# EAGLE schematic BatteryChargerCombiner (EAGLE 8.5.0)
Assembly variants: Wing, Hull

## Sheet 1 of 2
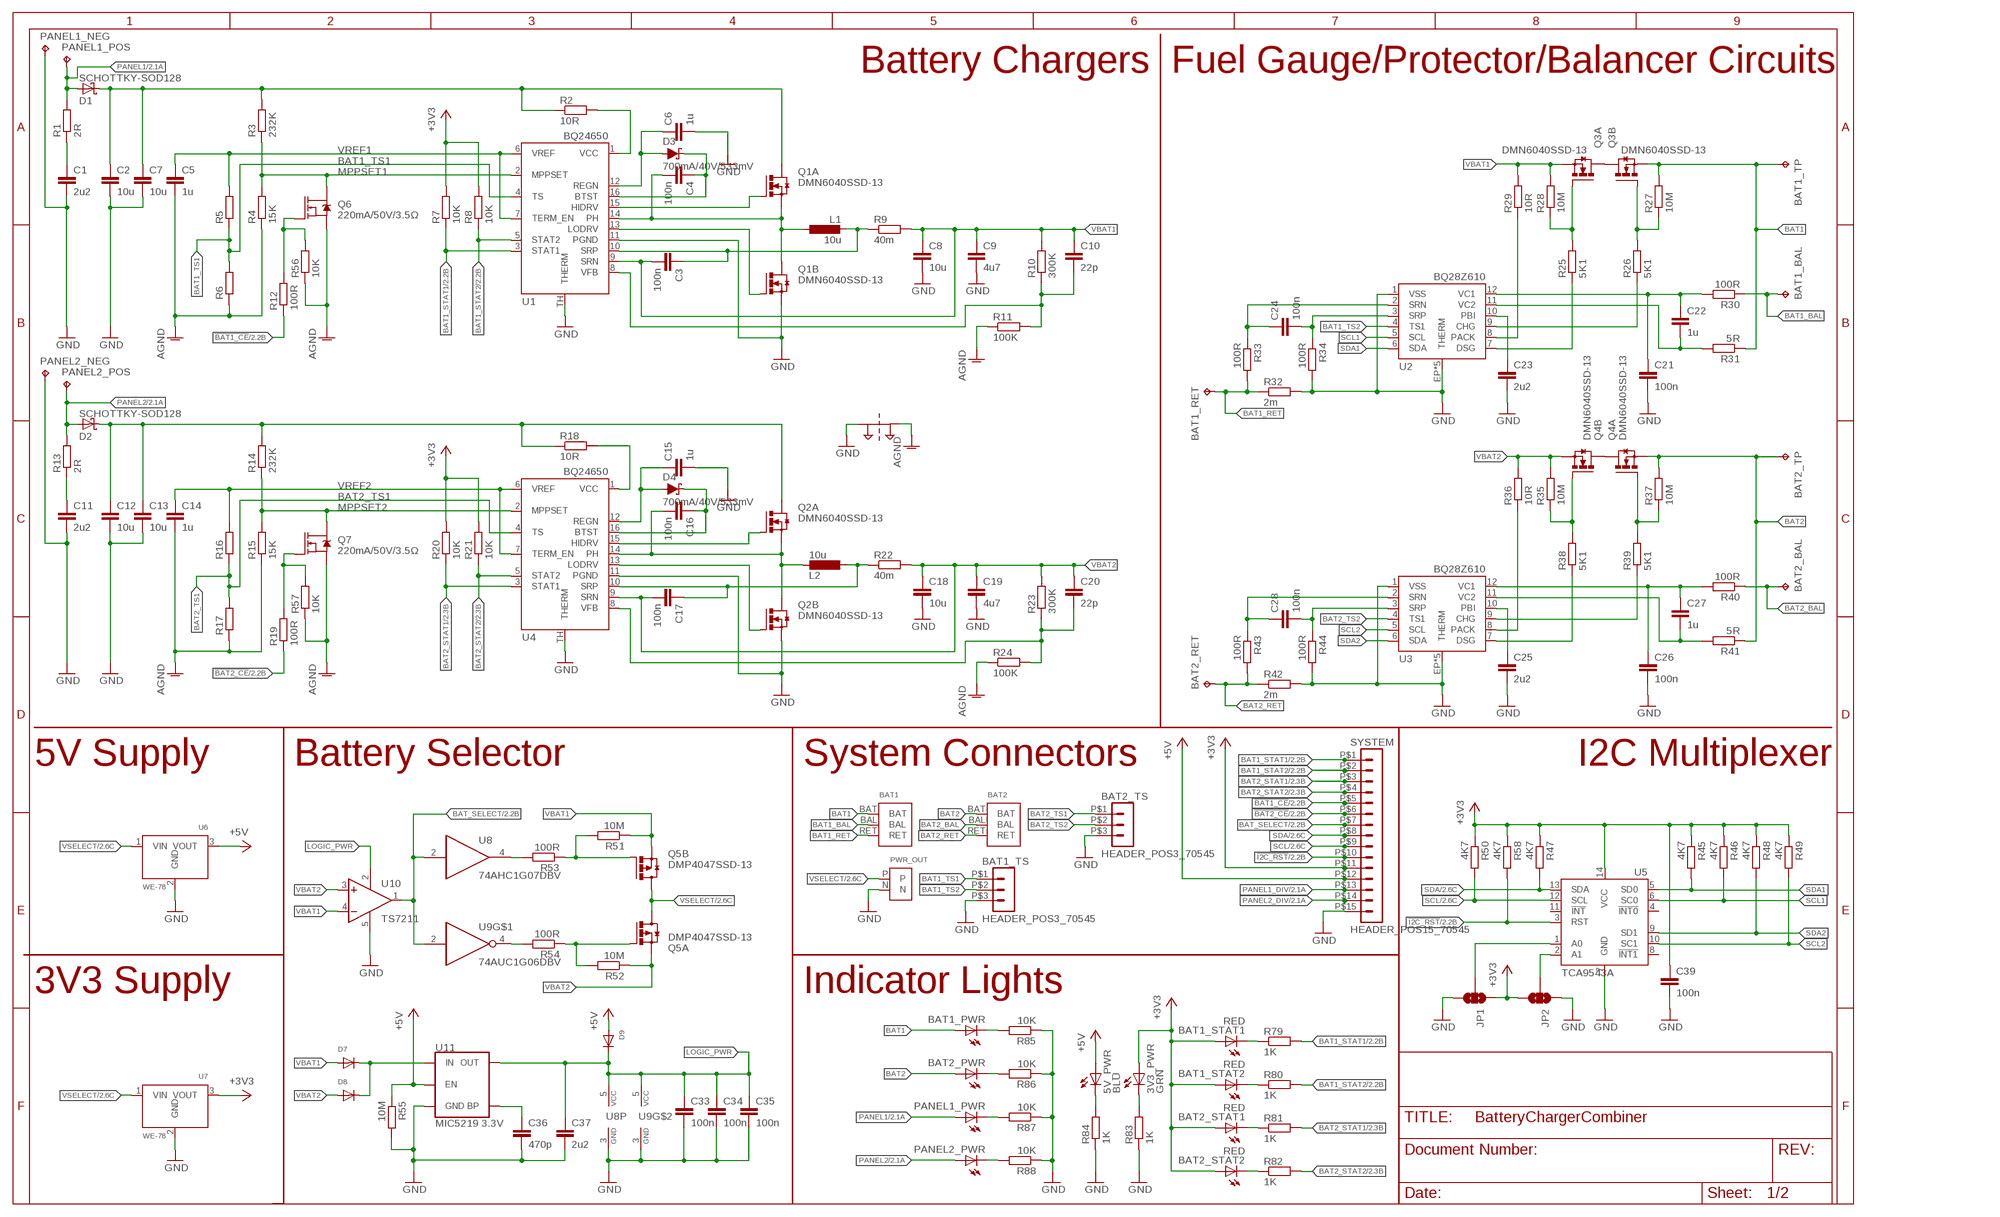
[diagram p0: schematic, sheet 1]

### Parts
3V3_PWR  GRN  LEDCHIP-LED0603  [CHIP-LED0603]
5V_PWR  BLU  LEDCHIP-LED0603  [CHIP-LED0603]
BAT1  2S-BATTERYSMD  [JST-XH3-SMD]
BAT1_BAL  TPPAD1-13Y  [P1-13Y]  (not fitted in variant Wing)  (not fitted in variant Hull)
BAT1_PWR  LEDCHIP-LED0603  [CHIP-LED0603]
BAT1_RET  TPPAD1-13Y  [P1-13Y]  (not fitted in variant Wing)  (not fitted in variant Hull)
BAT1_STAT1  RED  LEDCHIP-LED0603  [CHIP-LED0603]
BAT1_STAT2  RED  LEDCHIP-LED0603  [CHIP-LED0603]
BAT1_TP  TPPAD1-13Y  [P1-13Y]  (not fitted in variant Wing)  (not fitted in variant Hull)
BAT1_TS  HEADER_POS3_70545  [70545-POS3]
BAT2  2S-BATTERYSMD  [JST-XH3-SMD]
BAT2_BAL  TPPAD1-13Y  [P1-13Y]  (not fitted in variant Wing)  (not fitted in variant Hull)
BAT2_PWR  LEDCHIP-LED0603  [CHIP-LED0603]
BAT2_RET  TPPAD1-13Y  [P1-13Y]  (not fitted in variant Wing)  (not fitted in variant Hull)
BAT2_STAT1  RED  LEDCHIP-LED0603  [CHIP-LED0603]
BAT2_STAT2  RED  LEDCHIP-LED0603  [CHIP-LED0603]
BAT2_TP  TPPAD1-13Y  [P1-13Y]  (not fitted in variant Wing)  (not fitted in variant Hull)
BAT2_TS  HEADER_POS3_70545  [70545-POS3]
C1  2u2  C-EUC0603  [C0603]
C2  10u  C-EUC1210  [C1210]
C3  100n  C-EUC0603  [C0603]
C4  100n  C-EUC0603  [C0603]
C5  1u  C-EUC0603  [C0603]
C6  1u  C-EUC0603  [C0603]
C7  10u  C-EUC1210  [C1210]
C8  10u  C-EUC1210  [C1210]
C9  4u7  C-EUC1210  [C1210]
C10  22p  C-EUC0603  [C0603]
C11  2u2  C-EUC0603  [C0603]
C12  10u  C-EUC1210  [C1210]
C13  10u  C-EUC1210  [C1210]
C14  1u  C-EUC0603  [C0603]
C15  1u  C-EUC0603  [C0603]
C16  100n  C-EUC0603  [C0603]
C17  100n  C-EUC0603  [C0603]
C18  10u  C-EUC1210  [C1210]
C19  4u7  C-EUC1210  [C1210]
C20  22p  C-EUC0603  [C0603]
C21  100n  C-EUC0603  [C0603]
C22  1u  C-EUC0603  [C0603]
C23  2u2  C-EUC0603  [C0603]
C24  100n  C-EUC0603  [C0603]
C25  2u2  C-EUC0603  [C0603]
C26  100n  C-EUC0603  [C0603]
C27  1u  C-EUC0603  [C0603]
C28  100n  C-EUC0603  [C0603]
C33  100n  C-EUC0603  [C0603]
C34  100n  C-EUC0603  [C0603]
C35  100n  C-EUC0603  [C0603]
C36  470p  C-EUC0603  [C0603]
C37  2u2  C-EUC0603  [C0603]
C39  100n  C-EUC0603  [C0603]
D1  SCHOTTKY-SOD128  [SOD-128]
D2  SCHOTTKY-SOD128  [SOD-128]
D3  700mA/40V/533mV  DIODE-SCHOTTKY-ZLLS500  [SOT23-3]
D4  700mA/40V/533mV  DIODE-SCHOTTKY-ZLLS500  [SOT23-3]
D7  DIODESOD-123  [SOD-123]
D8  DIODESOD-123  [SOD-123]
D9  DIODESOD-123  [SOD-123]
JP1  JUMPER-SMT_3_NO_SILK  [SMT-JUMPER_3_NO_SILK]  (not fitted in variant Wing)  (not fitted in variant Hull)
JP2  JUMPER-SMT_3_NO_SILK  [SMT-JUMPER_3_NO_SILK]  (not fitted in variant Wing)  (not fitted in variant Hull)
L1  10u  INDUCTOR-DG6050  [DG6050]
L2  10u  INDUCTOR-DG6050  [DG6050]
PANEL1_NEG  TPPAD1-13Y  [P1-13Y]  (not fitted in variant Wing)  (not fitted in variant Hull)
PANEL1_POS  TPPAD1-13Y  [P1-13Y]  (not fitted in variant Wing)  (not fitted in variant Hull)
PANEL1_PWR  LEDCHIP-LED0603  [CHIP-LED0603]
PANEL2_NEG  TPPAD1-13Y  [P1-13Y]  (not fitted in variant Wing)  (not fitted in variant Hull)
PANEL2_POS  TPPAD1-13Y  [P1-13Y]  (not fitted in variant Wing)  (not fitted in variant Hull)
PANEL2_PWR  LEDCHIP-LED0603  [CHIP-LED0603]
PWR_OUT  PWR  [JST-XH2-THRUHOLE]  (not fitted in variant Wing)
Q1  DMN6040SSD-13  IRF8313P  [SO-08]
Q2  DMN6040SSD-13  IRF8313P  [SO-08]
Q3  DMN6040SSD-13  IRF8313P  [SO-08]
Q4  DMN6040SSD-13  IRF8313P  [SO-08]
Q5  DMP4047SSD-13  [SO08]
Q6  220mA/50V/3.5Ω  MOSFET-NCH-BSS138  [SOT23-3]
Q7  220mA/50V/3.5Ω  MOSFET-NCH-BSS138  [SOT23-3]
R1  2R  R-EU_R0603  [R0603]
R2  10R  R-EU_R1206  [R1206]
R3  232K  R-EU_R0603  [R0603]
R4  15K  R-EU_R0603  [R0603]
R5  R-EU_R0603  [R0603]
R6  R-EU_R0603  [R0603]
R7  10K  R-EU_R0603  [R0603]
R8  10K  R-EU_R0603  [R0603]
R9  40m  R-EU_R2512  [R2512]
R10  300K  R-EU_R0603  [R0603]
R11  100K  R-EU_R0603  [R0603]
R12  100R  R-EU_R0603  [R0603]
R13  2R  R-EU_R0603  [R0603]
R14  232K  R-EU_R0603  [R0603]
R15  15K  R-EU_R0603  [R0603]
R16  R-EU_R0603  [R0603]
R17  R-EU_R0603  [R0603]
R18  10R  R-EU_R1206  [R1206]
R19  100R  R-EU_R0603  [R0603]
R20  10K  R-EU_R0603  [R0603]
R21  10K  R-EU_R0603  [R0603]
R22  40m  R-EU_R2512  [R2512]
R23  300K  R-EU_R0603  [R0603]
R24  100K  R-EU_R0603  [R0603]
R25  5K1  R-EU_R0603  [R0603]
R26  5K1  R-EU_R0603  [R0603]
R27  10M  R-EU_R0603  [R0603]
R28  10M  R-EU_R0603  [R0603]
R29  10R  R-EU_R0603  [R0603]
R30  100R  R-EU_R0603  [R0603]
R31  5R  R-EU_R0603  [R0603]
R32  2m  R-EU_R2512  [R2512]
R33  100R  R-EU_R0603  [R0603]
R34  100R  R-EU_R0603  [R0603]
R35  10M  R-EU_R0603  [R0603]
R36  10R  R-EU_R0603  [R0603]
R37  10M  R-EU_R0603  [R0603]
R38  5K1  R-EU_R0603  [R0603]
R39  5K1  R-EU_R0603  [R0603]
R40  100R  R-EU_R0603  [R0603]
R41  5R  R-EU_R0603  [R0603]
R42  2m  R-EU_R2512  [R2512]
R43  100R  R-EU_R0603  [R0603]
R44  100R  R-EU_R0603  [R0603]
R45  4K7  R-EU_R0603  [R0603]
R46  4K7  R-EU_R0603  [R0603]
R47  4K7  R-EU_R0603  [R0603]
R48  4K7  R-EU_R0603  [R0603]
R49  4K7  R-EU_R0603  [R0603]
R50  4K7  R-EU_R0603  [R0603]
R51  10M  R-EU_R0603  [R0603]
R52  10M  R-EU_R0603  [R0603]
R53  100R  R-EU_R0603  [R0603]
R54  100R  R-EU_R0603  [R0603]
R55  10M  R-EU_R0603  [R0603]
R56  10K  R-EU_R0603  [R0603]
R57  10K  R-EU_R0603  [R0603]
R58  4K7  R-EU_R0603  [R0603]
R79  1K  R-EU_R0603  [R0603]
R80  1K  R-EU_R0603  [R0603]
R81  1K  R-EU_R0603  [R0603]
R82  1K  R-EU_R0603  [R0603]
R83  1K  R-EU_R0603  [R0603]
R84  1K  R-EU_R0603  [R0603]
R85  10K  R-EU_R0603  [R0603]
R86  10K  R-EU_R0603  [R0603]
R87  10K  R-EU_R0603  [R0603]
R88  10K  R-EU_R0603  [R0603]
SUPPLY1  2PT_GND_TIE  [2PT_GND_TIE]  (not fitted in variant Wing)  (not fitted in variant Hull)
SYSTEM  HEADER_POS15_70545  [70545-POS15]  (not fitted in variant Wing)
U1  BQ24650  [QFN16]
U2  BQ28Z610  [PDSO-N12]
U3  BQ28Z610  [PDSO-N12]
U4  BQ24650  [QFN16]
U5  TCA9543A  [SO-14]
U6  WE-78  [WE-78]
U7  WE-78  [WE-78]
U8  74AHC1G07DBV  [SOT23-5]
U9  74AUC1G06DBV  [SOT23-5]
U10  TS7211  [DBV-R-PDSO-G5]
U11  MIC5219 3.3V  V_REG_MIC52193.3V  [SOT23-5]

### Nets
!BAT1_CE!: R12.1 SYSTEM.P$5 ; also sheet 2
!BAT2_CE!: R19.1 SYSTEM.P$6 ; also sheet 2
!I2C_RST!: R58.2 SYSTEM.P$10 U5.3(RST) ; also sheet 2
+3V3: 3V3_PWR.A BAT1_STAT1.A BAT1_STAT2.A BAT2_STAT1.A BAT2_STAT2.A C39.1 JP1.1 JP2.3 R7.2 R8.2 R20.2 R21.2 R45.1 R46.1 R47.1 R48.1 R49.1 R50.1 R58.1 SYSTEM.P$11 U5.14(VCC) U7.3(VOUT) ; also sheet 2
+5V: 5V_PWR.A D9.A R55.1 SYSTEM.P$12 U6.3(VOUT) U11.3(EN) ; also sheet 2
AGND: C5.2 C14.2 Q6.2(S) Q7.2(S) R4.1 R6.1 R11.1 R15.1 R17.1 R24.1 R56.1 R57.1 SUPPLY1.P$2
BAT1: BAT1.BAT BAT1_PWR.A BAT1_TP.TP Q3.1(B:S) R27.2 R31.1
BAT1_BAL: BAT1.BAL BAT1_BAL.TP R30.1
BAT1_RET: BAT1.RET BAT1_RET.TP R32.1 R33.2
BAT1_STAT1: R7.1 R79.2 SYSTEM.P$1 U1.3(STAT1) ; also sheet 2
BAT1_STAT2: R8.1 R80.2 SYSTEM.P$2 U1.5(STAT2) ; also sheet 2
BAT1_TS1: BAT1_TS.P$1 R5.1 R6.2 U1.4(TS)
BAT1_TS2: BAT1_TS.P$2 U2.4(TS1)
BAT2: BAT2.BAT BAT2_PWR.A BAT2_TP.TP Q4.3(A:S) R37.2 R41.1
BAT2_BAL: BAT2.BAL BAT2_BAL.TP R40.1
BAT2_RET: BAT2.RET BAT2_RET.TP R42.1 R43.2
BAT2_STAT1: R20.1 R81.2 SYSTEM.P$3 U4.3(STAT1) ; also sheet 2
BAT2_STAT2: R21.1 R82.2 SYSTEM.P$4 U4.5(STAT2) ; also sheet 2
BAT2_TS1: BAT2_TS.P$1 R16.1 R17.2 U4.4(TS)
BAT2_TS2: BAT2_TS.P$2 U3.4(TS1)
BAT_SELECT: SYSTEM.P$7 U8.2(I) U9.2(I) U10.1(OUT) ; also sheet 2
GND: BAT1_TS.P$3 BAT2_TS.P$3 C1.2 C2.2 C6.2 C7.2 C8.2 C9.2 C11.2 C12.2 C13.2 C15.2 C18.2 C19.2 C21.2 C23.2 C25.2 C26.2 C33.2 C34.2 C35.2 C36.2 C37.2 C39.2 JP1.3 JP2.1 PANEL1_NEG.TP PANEL2_NEG.TP PWR_OUT.N Q1.1(B:S) Q2.1(B:S) R32.2 R34.2 R42.2 R44.2 R55.2 R83.1 R84.1 R85.1 R86.1 R87.1 R88.1 SUPPLY1.P$1 SYSTEM.P$15 U1.11(PGND) U1.TH(THERM) U2.1(VSS) U2.EP1(THERM) U2.EP2(THERM) U2.EP3(THERM) U2.EP4(THERM) U2.EP(THERM) U3.1(VSS) U3.EP1(THERM) U3.EP2(THERM) U3.EP3(THERM) U3.EP4(THERM) U3.EP(THERM) U4.11(PGND) U4.TH(THERM) U5.7(GND) U6.2(GND) U7.2(GND) U8.3(GND) U9.3(GND) U10.5(GND) U11.2(GND) ; also sheet 2
LOGIC_PWR: C33.1 C34.1 C35.1 C37.1 D9.C U8.5(VCC) U9.5(VCC) U10.2(V+) U11.5(OUT)
MPPSET1: Q6.3(D) R3.1 R4.2 U1.2(MPPSET)
MPPSET2: Q7.3(D) R14.1 R15.2 U4.2(MPPSET)
N$1: C1.1 R1.1
N$3: R2.2 U1.1(VCC)
N$4: C2.1 C7.1 D1.C Q1.5(A:D) Q1.6(A:D) R2.1 R3.2
N$5: Q1.4(A:G) U1.15(HIDRV)
N$6: C4.2 L1.1 Q1.3(A:S) Q1.7(B:D) Q1.8(B:D) U1.14(PH)
N$7: Q1.2(B:G) U1.13(LODRV)
N$8: Q6.1(G) R12.2 R56.2
N$9: C3.1 L1.2 R9.1 U1.10(SRP)
N$10: C4.1 D3.3(C) U1.16(BTST)
N$11: C6.1 D3.1(A) U1.12(REGN)
N$12: C10.2 R10.1 R11.2 U1.8(VFB)
N$13: Q2.4(A:G) U4.15(HIDRV)
N$14: BAT1_STAT1.C R79.1
N$15: C11.1 R13.1
N$16: C15.1 D4.1(A) U4.12(REGN)
N$17: C16.1 D4.3(C) U4.16(BTST)
N$18: R29.1 U2.8(PACK)
N$19: C12.1 C13.1 D2.C Q2.5(A:D) Q2.6(A:D) R14.2 R18.1
N$20: C16.2 L2.2 Q2.3(A:S) Q2.7(B:D) Q2.8(B:D) U4.14(PH)
N$21: Q2.2(B:G) U4.13(LODRV)
N$22: C17.1 L2.1 R22.1 U4.10(SRP)
N$23: R18.2 U4.1(VCC)
N$24: Q7.1(G) R19.2 R57.2
N$25: Q3.5(A:D) Q3.6(A:D) Q3.7(B:D) Q3.8(B:D)
N$26: Q3.4(A:G) R25.2 R28.1
N$27: C20.2 R23.1 R24.2 U4.8(VFB)
N$28: Q3.2(B:G) R26.2 R27.1
N$29: R25.1 U2.7(DSG)
N$30: Q4.5(A:D) Q4.6(A:D) Q4.7(B:D) Q4.8(B:D)
N$31: R26.1 U2.9(CHG)
N$32: C21.1 C22.1 R30.2 U2.12(VC1)
N$33: C22.2 R31.2 U2.11(VC2)
N$34: C23.1 U2.10(PBI)
N$35: C27.2 R41.2 U3.11(VC2)
N$36: C28.1 R43.1 U3.2(SRN)
N$37: C24.1 R33.1 U2.2(SRN)
N$38: Q4.2(B:G) R35.1 R38.2
N$39: C24.2 R34.1 U2.3(SRP)
N$40: Q4.4(A:G) R37.1 R39.2
N$41: C26.1 C27.1 R40.2 U3.12(VC1)
N$42: R36.1 U3.8(PACK)
N$43: R38.1 U3.7(DSG)
N$44: R39.1 U3.9(CHG)
N$45: C25.1 U3.10(PBI)
N$46: C28.2 R44.1 U3.3(SRP)
N$47: BAT1_STAT2.C R80.1
N$48: Q5.4(B:G) R51.2 R53.1
N$49: BAT2_STAT1.C R81.1
N$50: JP1.2 U5.1(A0)
N$51: JP2.2 U5.2(A1)
N$52: Q5.2(A:G) R52.2 R54.1
N$54: R54.2 U9.4(O)
N$55: R53.2 U8.4(O)
N$56: BAT2_STAT2.C R82.1
N$57: D7.C D8.C U11.1(IN)
N$59: C36.1 U11.4(BP)
N$74: 3V3_PWR.C R83.2
N$77: 5V_PWR.C R84.2
N$81: BAT1_PWR.C R85.2
N$82: BAT2_PWR.C R86.2
N$83: PANEL1_PWR.C R87.2
N$84: PANEL2_PWR.C R88.2
PANEL1: D1.A PANEL1_POS.TP PANEL1_PWR.A R1.2 ; also sheet 2
PANEL1_DIV: SYSTEM.P$13 ; also sheet 2
PANEL2: D2.A PANEL2_POS.TP PANEL2_PWR.A R13.2 ; also sheet 2
PANEL2_DIV: SYSTEM.P$14 ; also sheet 2
SCL: R50.2 SYSTEM.P$9 U5.12(SCL) ; also sheet 2
SCL1: R46.2 U2.5(SCL) U5.6(SC0)
SCL2: R49.2 U3.5(SCL) U5.10(SC1)
SDA: R47.2 SYSTEM.P$8 U5.13(SDA) ; also sheet 2
SDA1: R45.2 U2.6(SDA) U5.5(SD0)
SDA2: R48.2 U3.6(SDA) U5.9(SD1)
VBAT1: C3.2 C8.1 C9.1 C10.1 D7.A Q3.3(A:S) Q5.3(B:S) R9.2 R10.2 R28.2 R29.2 R51.1 U1.9(SRN) U10.4(-IN)
VBAT2: C17.2 C18.1 C19.1 C20.1 D8.A Q4.1(B:S) Q5.1(A:S) R22.2 R23.2 R35.2 R36.2 R52.1 U4.9(SRN) U10.3(+IN)
VREF1: C5.1 R5.2 U1.6(VREF) U1.7(TERM_EN)
VREF2: C14.1 R16.2 U4.6(VREF) U4.7(TERM_EN)
VSELECT: PWR_OUT.P Q5.5(B:D) Q5.6(B:D) Q5.7(A:D) Q5.8(A:D) U6.1(VIN) U7.1(VIN) ; also sheet 2
Unconnected: U5.4(!INT0!) U5.8(!INT1!) U5.11(!INT!)

### Notes on the sheet
- Battery Chargers | Fuel Gauge/Protector/Balancer Circuits
- 5V Supply | Battery Selector | System Connectors | I2C Multiplexer
- 3V3 Supply | Indicator Lights

## Sheet 2 of 2
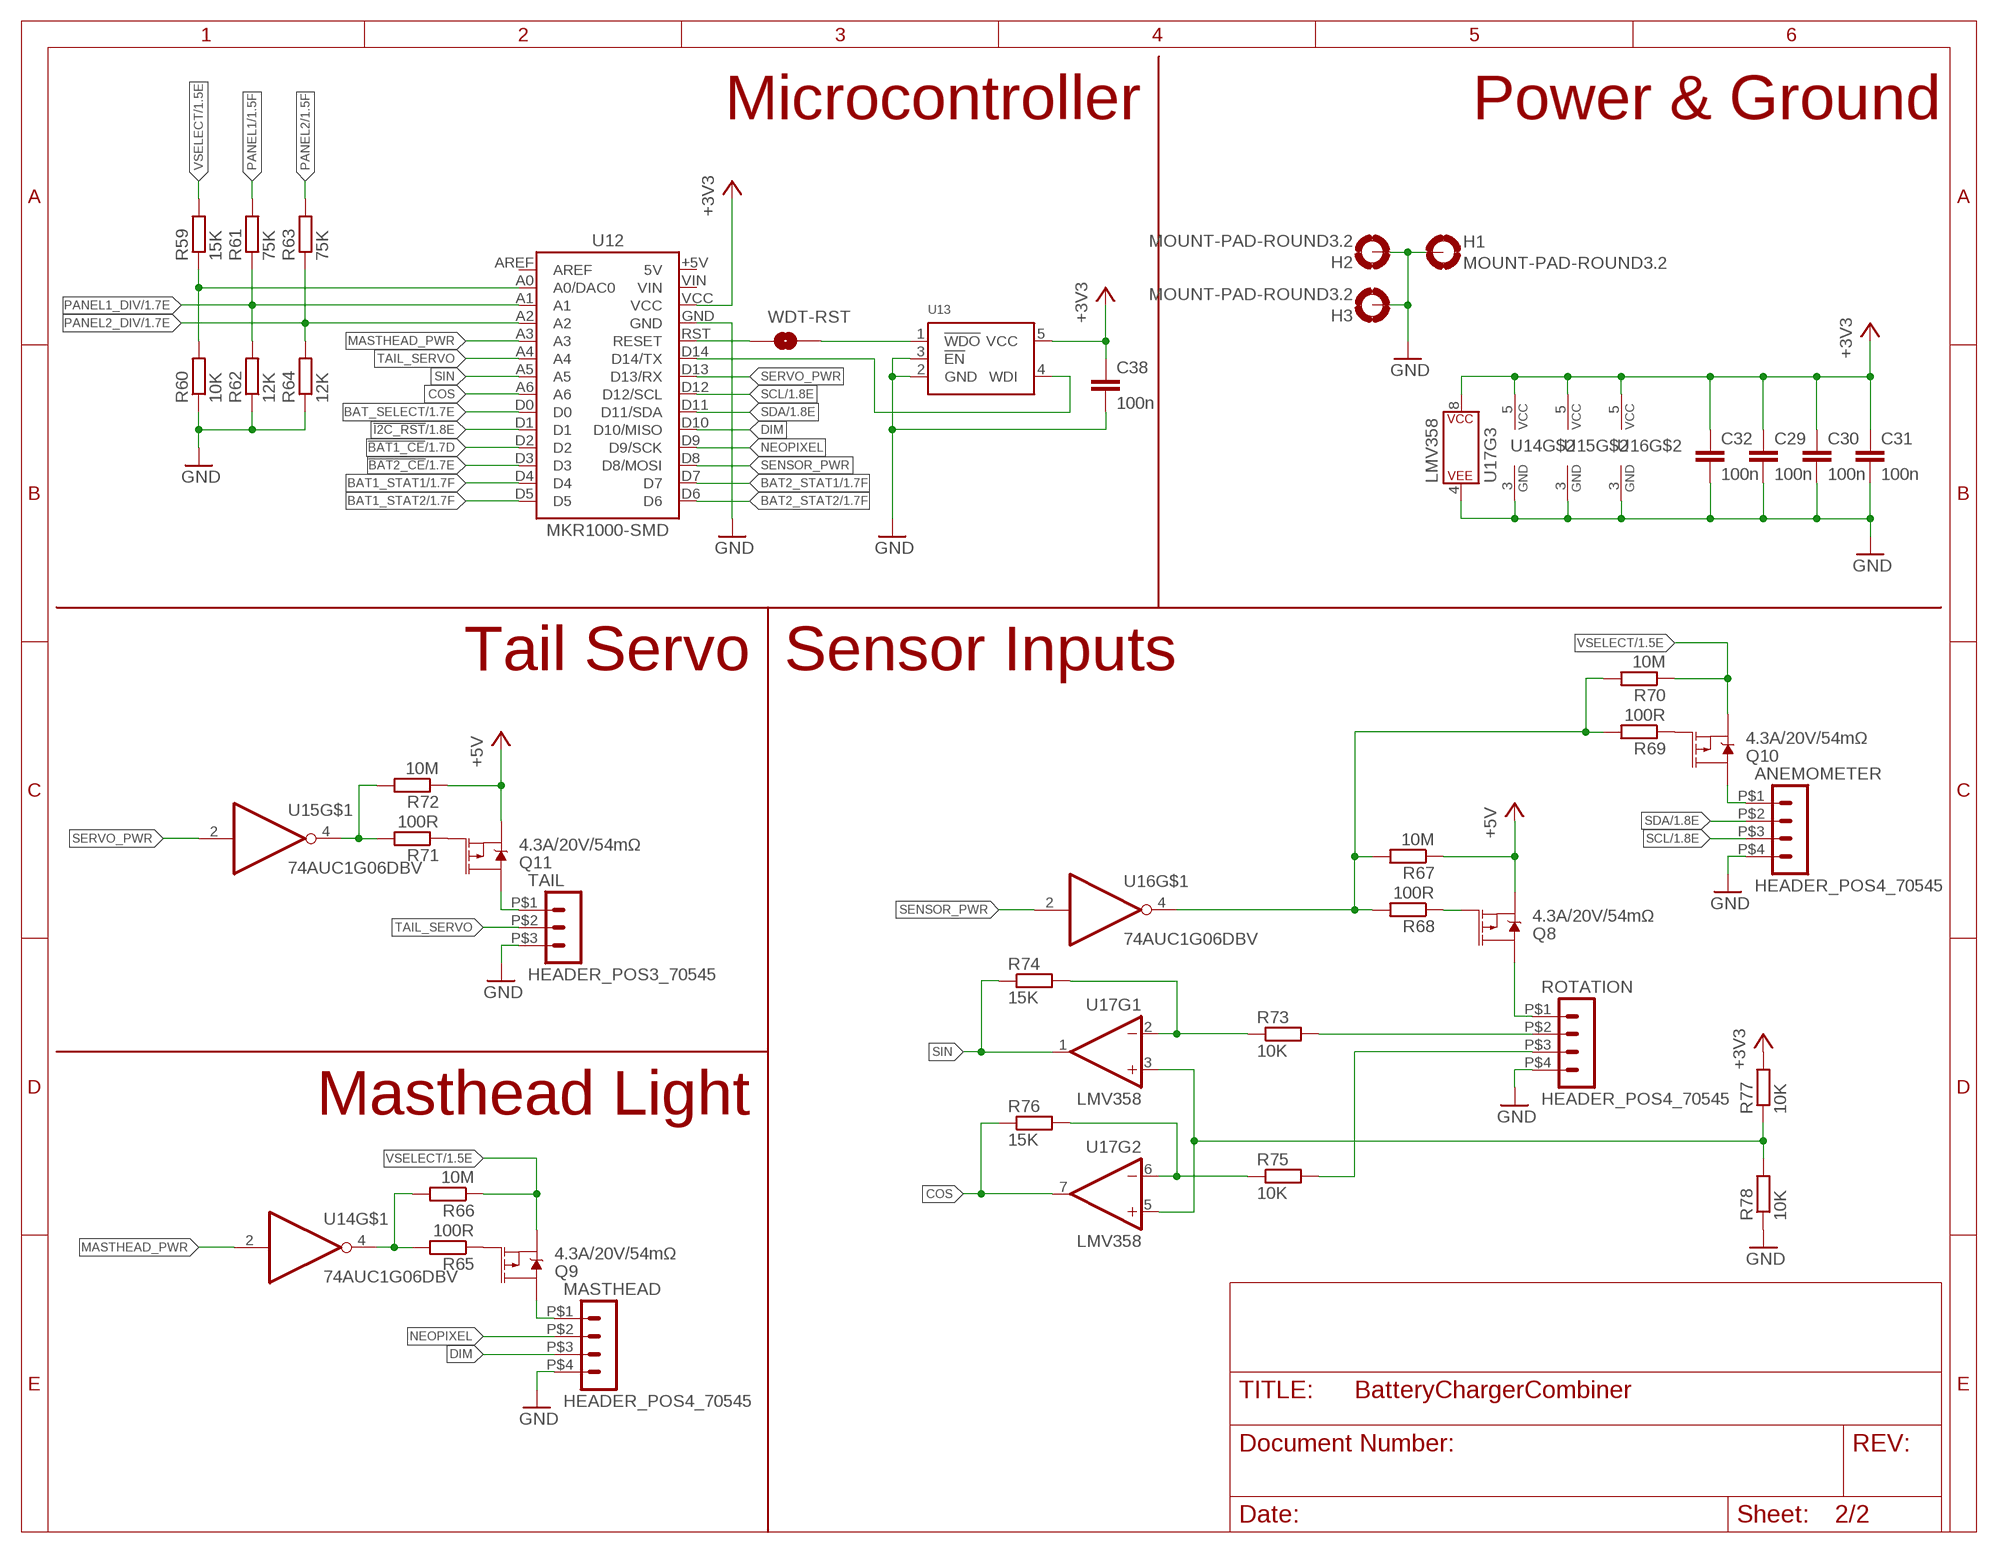
[diagram p1: schematic, sheet 2]

### Parts
ANEMOMETER  HEADER_POS4_70545  [70545-POS4]  (not fitted in variant Hull)
C29  100n  C-EUC0603  [C0603]
C30  100n  C-EUC0603  [C0603]
C31  100n  C-EUC0603  [C0603]
C32  100n  C-EUC0603  [C0603]
C38  100n  C-EUC0603  [C0603]
H1  MOUNT-PAD-ROUND3.2  [3,2-PAD]  (not fitted in variant Wing)  (not fitted in variant Hull)
H2  MOUNT-PAD-ROUND3.2  [3,2-PAD]  (not fitted in variant Wing)  (not fitted in variant Hull)
H3  MOUNT-PAD-ROUND3.2  [3,2-PAD]  (not fitted in variant Wing)  (not fitted in variant Hull)
MASTHEAD  HEADER_POS4_70545  [70545-POS4]  (not fitted in variant Hull)
Q8  4.3A/20V/54mΩ  MOSFET_PCH-IRLML2244  [SOT23-3]
Q9  4.3A/20V/54mΩ  MOSFET_PCH-IRLML2244  [SOT23-3]
Q10  4.3A/20V/54mΩ  MOSFET_PCH-IRLML2244  [SOT23-3]
Q11  4.3A/20V/54mΩ  MOSFET_PCH-IRLML2244  [SOT23-3]
R59  15K  R-EU_R0603  [R0603]
R60  10K  R-EU_R0603  [R0603]
R61  75K  R-EU_R0603  [R0603]
R62  12K  R-EU_R0603  [R0603]
R63  75K  R-EU_R0603  [R0603]
R64  12K  R-EU_R0603  [R0603]
R65  100R  R-EU_R0603  [R0603]
R66  10M  R-EU_R0603  [R0603]
R67  10M  R-EU_R0603  [R0603]
R68  100R  R-EU_R0603  [R0603]
R69  100R  R-EU_R0603  [R0603]
R70  10M  R-EU_R0603  [R0603]
R71  100R  R-EU_R0603  [R0603]
R72  10M  R-EU_R0603  [R0603]
R73  10K  R-EU_R0603  [R0603]
R74  15K  R-EU_R0603  [R0603]
R75  10K  R-EU_R0603  [R0603]
R76  15K  R-EU_R0603  [R0603]
R77  10K  R-EU_R0603  [R0603]
R78  10K  R-EU_R0603  [R0603]
ROTATION  HEADER_POS4_70545  [70545-POS4]  (not fitted in variant Hull)
TAIL  HEADER_POS3_70545  [70545-POS3]  (not fitted in variant Hull)
U12  MKR1000-SMD  [MKR1000-SMD]  (not fitted in variant Hull)
U13  STWD100  [DBV-R-PDSO-G5]  (not fitted in variant Hull)
U14  74AUC1G06DBV  [SOT23-5]
U15  74AUC1G06DBV  [SOT23-5]
U16  74AUC1G06DBV  [SOT23-5]
U17  LMV358  LMV358SOIC  [SO08]
WDT-RST  JUMPER-SMT_2_NO_SILK  [SMT-JUMPER_2_NO_SILK]  (not fitted in variant Wing)  (not fitted in variant Hull)

### Nets
!BAT1_CE!: U12.D2 ; also sheet 1
!BAT2_CE!: U12.D3 ; also sheet 1
!I2C_RST!: U12.D1 ; also sheet 1
+3V3: C29.1 C30.1 C31.1 C32.1 C38.1 R77.2 U12.VCC U13.5(VCC) U14.5(VCC) U15.5(VCC) U16.5(VCC) U17.8(P$V+) ; also sheet 1
+5V: Q8.2(S) Q11.2(S) R67.1 R72.1 ; also sheet 1
BAT1_STAT1: U12.D4 ; also sheet 1
BAT1_STAT2: U12.D5 ; also sheet 1
BAT2_STAT1: U12.D7 ; also sheet 1
BAT2_STAT2: U12.D6 ; also sheet 1
BAT_SELECT: U12.D0 ; also sheet 1
COS: R76.1 U12.A6 U17.7(OUT)
COS_IN: R75.2 ROTATION.P$3
DIM: MASTHEAD.P$3 U12.D10(D10/MISO)
GND: ANEMOMETER.P$4 C29.2 C30.2 C31.2 C32.2 C38.2 H1.B3,2(MOUNT) H2.B3,2(MOUNT) H3.B3,2(MOUNT) MASTHEAD.P$4 R60.1 R62.1 R64.1 R78.1 ROTATION.P$4 TAIL.P$3 U12.GND U13.2(GND) U13.3(!EN!) U14.3(GND) U15.3(GND) U16.3(GND) U17.4(P$V-) ; also sheet 1
MASTHEAD_PWR: U12.A3 U14.2(I)
N$2: Q8.3(D) ROTATION.P$1
N$53: Q8.1(G) R68.1
N$58: MASTHEAD.P$1 Q9.3(D)
N$60: R59.1 R60.2 U12.A0(A0/DAC0)
N$61: U12.RST(RESET) WDT-RST.1
N$62: R73.1 R74.2 U17.2(-IN)
N$63: Q9.1(G) R65.1
N$64: R65.2 R66.2 U14.4(O)
N$65: U13.1(!WDO!) WDT-RST.2
N$66: ANEMOMETER.P$1 Q10.3(D)
N$67: Q10.1(G) R69.1
N$68: U12.D14(D14/TX) U13.4(WDI)
N$69: R67.2 R68.2 R69.2 R70.2 U16.4(O)
N$70: Q11.3(D) TAIL.P$1
N$71: Q11.1(G) R71.1
N$72: R71.2 R72.2 U15.4(O)
N$73: R75.1 R76.2 U17.6(-IN)
N$78: R77.1 R78.2 U17.3(+IN) U17.5(+IN)
NEOPIXEL: MASTHEAD.P$2 U12.D9(D9/SCK)
PANEL1: R61.2 ; also sheet 1
PANEL1_DIV: R61.1 R62.2 U12.A1 ; also sheet 1
PANEL2: R63.2 ; also sheet 1
PANEL2_DIV: R63.1 R64.2 U12.A2 ; also sheet 1
SCL: ANEMOMETER.P$3 U12.D12(D12/SCL) ; also sheet 1
SDA: ANEMOMETER.P$2 U12.D11(D11/SDA) ; also sheet 1
SENSOR_PWR: U12.D8(D8/MOSI) U16.2(I)
SERVO_PWR: U12.D13(D13/RX) U15.2(I)
SIN: R74.1 U12.A5 U17.1(OUT)
SIN_IN: R73.2 ROTATION.P$2
TAIL_SERVO: TAIL.P$2 U12.A4
VSELECT: Q9.2(S) Q10.2(S) R59.2 R66.1 R70.1 ; also sheet 1
Unconnected: U12.+5V(5V) U12.AREF U12.VIN

### Notes on the sheet
- Microcontroller | Power & Ground
- Tail Servo | Sensor Inputs
- Masthead Light

## Library data of the parts
3V3_PWR 5V_PWR BAT1_PWR BAT1_STAT1 BAT1_STAT2 BAT2_PWR BAT2_STAT1 BAT2_STAT2 PANEL1_PWR PANEL2_PWR = adafruit:LED: LED OSRAM: - CHIPLED LG R971, LG N971, LY N971, LG Q971, LY Q971, LO R971, LY R971 LH N974, LH R974 LS Q976, LO Q976, LY Q976 LO Q996 - Hyper CHIPLED LW Q18S LB Q993, LB Q99A, LB R99A - SideLED LS A670, LO A670, LY A670, LG A670, LP A670 LB A673, LV A673, LT A673, LW A673 LH A674 LY A675 LS A676, LA A676, LO A676, LY A676, LW A676 LS A679, LY A679, LG A679 - Hyper Micro SIDELED® LS Y876, LA Y876, LO Y876, LY Y876 LT Y87S - SmartLED LW L88C, LW L88S LB L89C, LB L89S, LG L890 LS L89K, LO L89K, LY L89K LS L896, LA L896, LO L896, LY L896 - TOPLED LS T670, LO T670, LY T670, LG T670, LP T670 LSG T670, LSP T670, LSY T670, LOP T670, LYG T670 LG T671, LOG T671, LSG T671 LB T673, LV T673, LT T673, LW T673 LH T674 LS T676, LA T676, LO T676, LY T676, LB T676, LH T676, LSB T676, LW T676 LB T67C, LV T67C, LT T67C, LS T67K, LO T67K, LY T67K, LW E67C LS E67B, LA E67B, LO E67B, LY E67B, LB E67C, LV E67C, LT E67C LW T67C LS T679, LY T679, LG T679 LS T770, LO T770, LY T770, LG T770, LP T770 LB T773, LV T773, LT T773, LW T773 LH T774 LS E675, LA E675, LY E675, LS T675 LS T776, LA T776, LO T776, LY T776, LB T776 LHGB T686 LT T68C, LB T68C - Hyper Mini TOPLED® LB M676 - Mini TOPLED Santana® LG M470 LS M47K, LO M47K, LY M47K Source: http://www.osram.convergy.de/
ANEMOMETER MASTHEAD ROTATION = con-molex-c-grid-sl:HEADER_POS4_?: Molex -C-Grid® / SL Series connector Wire-to-Board 2.54 mm (0.100") pitch header, 4 positions.
BAT1 BAT2 = PowerComponents:2S-BATTERY: JST XH connector for a 2S LiPo battery with balancing
BAT1_BAL BAT1_RET BAT1_TP BAT2_BAL BAT2_RET BAT2_TP PANEL1_NEG PANEL1_POS PANEL2_NEG PANEL2_POS = testpad:TP: Test pad
BAT1_TS BAT2_TS TAIL = con-molex-c-grid-sl:HEADER_POS3_?: Molex -C-Grid® / SL Series connector Wire-to-Board 2.54 mm (0.100") pitch header, 3 positions.
C1-C39 = resistor:C-EU: CAPACITOR, European symbol
D1 D2 = PowerComponents:SCHOTTKY
D3 D4 = SparkFun-DiscreteSemi:DIODE-SCHOTTKY: Schottky diode A Schottky diode is a semiconductor diode which has a low forward voltage drop and a very fast switching action.; PROD_ID: DIO-08411
D7-D9 = adafruit:DIODE: Diode SMADIODE - SMA Surface Mount Package 20V 1A Schottky Diode Digikey: 641-1014-6-ND DO-1N4148 - Through Hole Small Current Diode SOD-123 20V 1 A (.5mV Vf) Schottky Diode - Digikey: MBRX120TPMSCT-ND SOD-323 10V 570mA (.38mV Vf, 3ns) Schottky Diode - Digikey: ZLLS410CT-ND SOD-523 30V 30mA Schottky Diode (RB751S-40TE61) - Digikey: RB751S-40TE61CT-ND SOT23-R/W - SOT23 Package (R = Solder Paste/Reflow Ovens, W = Hand-Soldering) BAT54Film 40V 300mA - Digikey: 497-7162-1-ND
H1-H3 = holes:MOUNT-PAD-ROUND: MOUNTING PAD, round
JP1 JP2 = SparkFun-Jumpers:JUMPER-SMT_3_NO: Normally open jumper This jumper has three pads in close proximity to each other. Apply solder to close the connection(s).
L1 L2 = PowerComponents:INDUCTOR
PWR_OUT = PowerComponents:PWR
Q1-Q4 = transistor-power:IRF8313P: HEXFET(R) Power MOSFET Source: Data sheet <http://www.irf.com/product-info/datasheets/data/irf8313pbf.pdf>
Q5 = PowerComponents:DMP4047SSD-13: Dual P MOSFET
Q6 Q7 = SparkFun-DiscreteSemi:MOSFET-NCH: N-channel MOSFETs Voltage controlled devices that allow control of high current outputs. SparkFun Products: SparkFun OpenScale <https://www.sparkfun.com/products/13261> SparkFun Digital Sandbox <https://www.sparkfun.com/products/12651> SparkFun Monster Moto Shield <https://www.sparkfun.com/products/10182> SparkFun MOSFET Power Controller <https://www.sparkfun.com/products/11214>; PROD_ID: TRANS-00830
Q8-Q11 = SparkFun-DiscreteSemi:MOSFET_PCH: P-channel MOSFETs Voltage controlled devices that allow control of high current outputs. SparkFun Products: SparkFun ESP32 Thing <https://www.sparkfun.com/products/13907> SparkFun ESP8266 Thing <https://www.sparkfun.com/products/13231>; PROD_ID: TRANS-11153
R1-R88 = resistor:R-EU_: RESISTOR, European symbol
SUPPLY1 = SparkFun-PowerSymbols:2PT_GND_TIE: Dual Ground Supply Power supply symbol for connecting two grounds. SparkFun Products: SparkFun AutoDriver - Stepper Motor Driver <https://www.sparkfun.com/products/11611>
SYSTEM = con-molex-c-grid-sl:HEADER_POS15_?: Molex -C-Grid® / SL Series connector Wire-to-Board 2.54 mm (0.100") pitch header, 15 positions.
U1 U4 = PowerComponents:BQ24650: TI LiPo charger with MPPT
U2 U3 = PowerComponents:BQ28Z610: 2S LiPo balancer/fuel gauge
U5 = PowerComponents:TCA9543A: 2 port I2C mux
U6 U7 = PowerComponents:WE-78
U8 = 74xx-little-us:74*1G07: Single Buffer/Driver With Open-Drain Output
U9 U14-U16 = 74xx-little-us:74*1G06: Single Inverter Buffer/Driver With Open-Drain Output
U10 = PowerComponents:TS7211: Single rail to rail differential comparator. Source: datasheet <http://www.st.com/content/ccc/resource/technical/document/datasheet/3e/f6/43/6f/0f/1f/48/68/CD00003022.pdf/files/CD00003022.pdf/jcr:content/translations/en.CD00003022.pdf>
U11 = SparkFun-IC-Power:V_REG_MIC5219: V_REG MIC5219 Standard 3.3V and 5V 500mA LDO voltage regulator in SOT-23 layout. Micrel part MIC5219. BP (by-pass) pin is used to lower output noise with 470pF cap, may be left open.; PROD_ID: VREG-09872
U12 = arduino-shields:MKR: Through hole version can use any 0.1" headers. SMD version uses Mill-Max p/n 310-43-114-41-105000. This requires a machined-pin header such as the Mill-Max p/n 350-10-114-00-006000.
U13 = PowerComponents:STWD100
U17 = SparkFun-IC-Amplifiers:LMV358: IC LMV358 DUAL OP AMP Jellybean rail-to-rail output op-amp SparkFun Products SparkFun PicoBoard <https://www.sparkfun.com/products/11888> (WIG-11888) SparkFun Vernier Interface Shield <https://www.sparkfun.com/products/12858> (DEV-12858) SparkFun Blynk Board - ESP8266 <https://www.sparkfun.com/products/13794> (WRL-13794) SparkFun Digital Sandbox <https://www.sparkfun.com/products/12651> (DEV-12651 RoHS); PROD_ID: IC-09657
WDT-RST = SparkFun-Jumpers:JUMPER-SMT_2_NO: Normally open jumper This jumper has two pads in close proximity to each other. Apply solder to close the connection. Round pads are easier to solder for beginners, but are a lot larger. SparkFun Product that uses the round pads: SparkFun EL Sequencer <https://www.sparkfun.com/products/12781>